# Altium project FreeJoy Controller Lite.PrjPcb
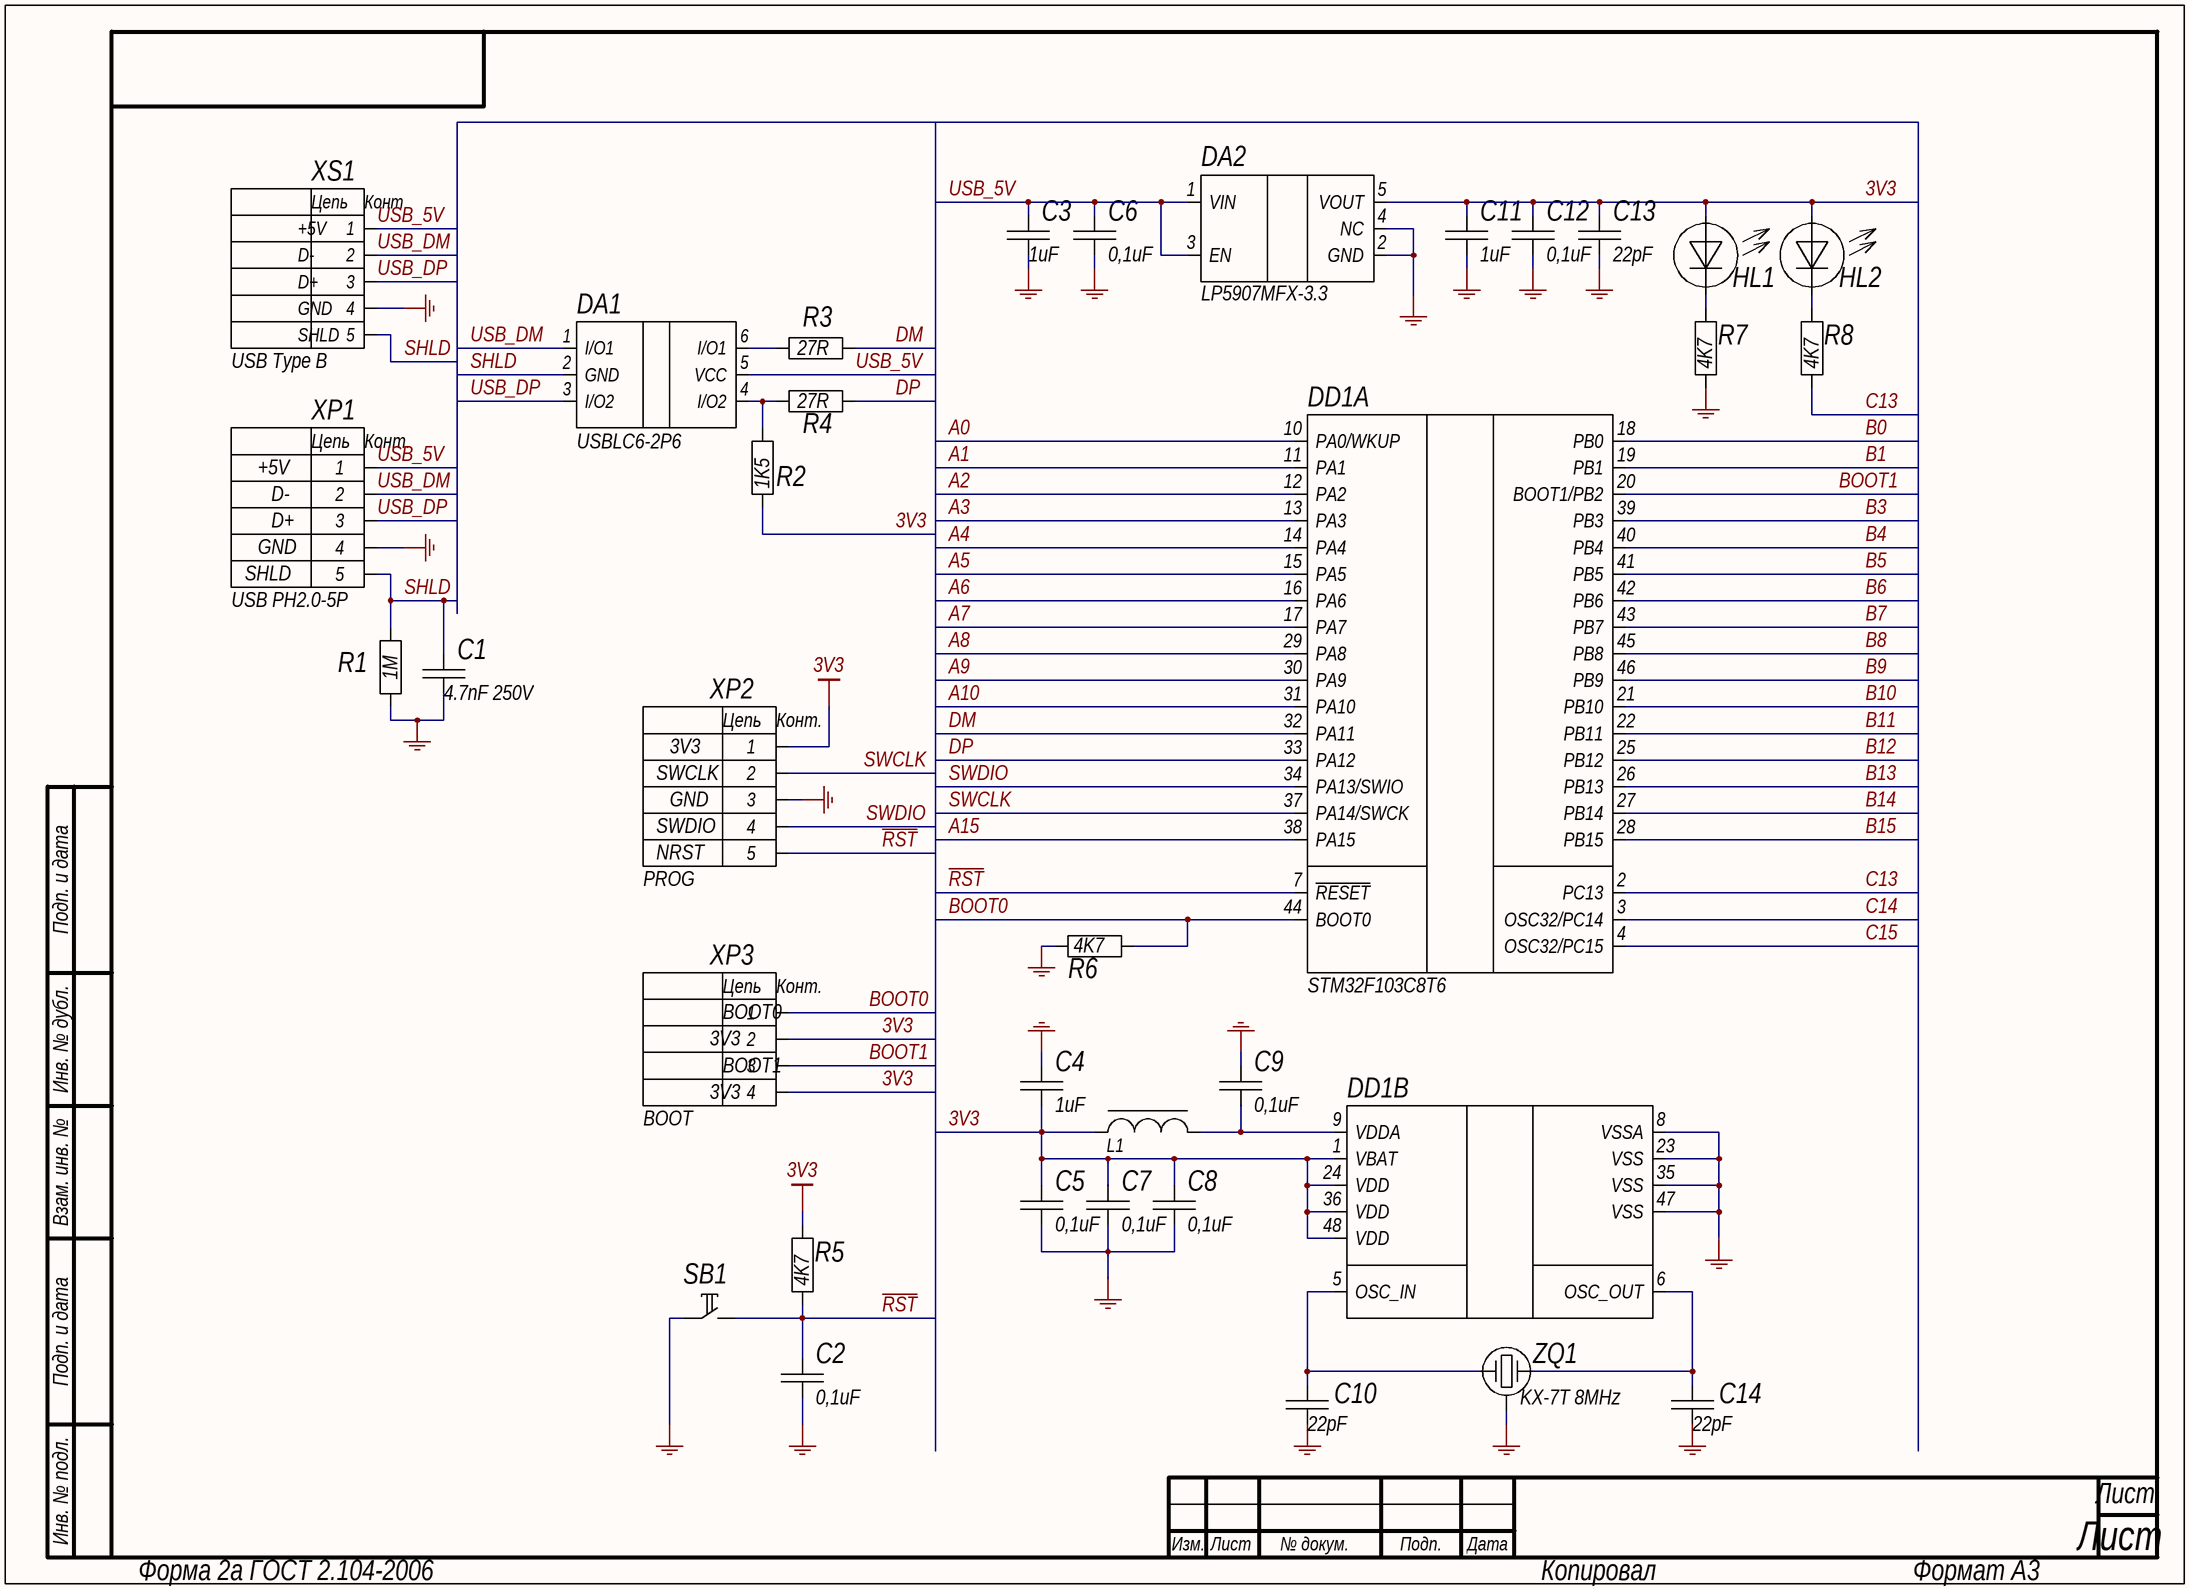
[diagram p0: Sheet1.SchDoc]
2 sheets, 47 parts. Net scope: global (net labels, ports and power ports of the same name join across sheets).
Board file: FreeJoy Controller Lite.PcbDoc
Sheets:
  Sheet1.SchDoc
  Sheet2.SchDoc

## Sheet Sheet1.SchDoc: =GlobalProjectName
size 410 x 297 mm; ApprovedBy: Утвердил; CheckedBy: Проверил; Author: Разработал; SheetNumber: Лист; SheetTotal: 1; PageSetup: Record=PageOptions|CenterHorizontal=True|CenterVertical=True|PrintScale=1.00|XCorrection=1.00|YCorrection=1.00|PrintKind=1|BorderSize=5000000|LeftOffset=0|BottomOffset=0|Orientation=2|PaperLength=1000|PaperWidth=1000|Scale=100|PaperSource=15|PrintQuality=1200|MediaType=1|DitherType=10|PaperKind=A3|PrintScaleMode=1; Weight: -; ScaleFactor: -; NormInspection: Норм.Контр.; Time: Листов

### Parts
C1  4.7nF 250V  [CC0805_HD]
C2  value 0,1uF  [CC0603_HD]  (hidden comment: 100nF)
C3  1uF  [CC0603_HD]
C4  1uF  [CC0603_HD]
C5  value 0,1uF  [CC0603_HD]  (hidden comment: 100nF)
C6  value 0,1uF  [CC0603_HD]  (hidden comment: 100nF)
C7  value 0,1uF  [CC0603_HD]  (hidden comment: 100nF)
C8  value 0,1uF  [CC0603_HD]  (hidden comment: 100nF)
C9  value 0,1uF  [CC0603_HD]  (hidden comment: 100nF)
C10  22pF  [CC0603_HD]
C11  1uF  [CC0603_HD]
C12  value 0,1uF  [CC0603_HD]  (hidden comment: 100nF)
C13  22pF  [CC0603_HD]
C14  22pF  [CC0603_HD]
DA1  USBLC6-2P6  [SOT666]
DA2  LP5907MFX-3.3  [SOT23-5]
DD1  STM32F103C8T6  [LQFP48]  (parts A,B of 2)
HL1  KP-1608SRC  [LED0603R_HD]  (value not drawn)
HL2  KP-1608SGC  [LED0603G_HD]  (value not drawn)
L1  Ferrite bead, BLM18HG102SN1D  [RC0603_HD]  (value not drawn)
R1  1M  [RC0603_HD]
R2  1K5  [RC0603_HD]
R3  27R  [RC0603_HD]
R4  27R  [RC0603_HD]
R5  4K7  [RC0603_HD]
R6  4K7  [RC0603_HD]
R7  4K7  [RC0603_HD]
R8  4K7  [RC0603_HD]
SB1  Tact Switch 3.5x6mm THT  [DTS-32]  (value not drawn)
XP1  USB PH2.0-5P  [PH2.0-5P]
XP2  PROG  [PLS-5]
XP3  BOOT  [PLD-4]
XS1  USB Type B  [DS1099-B]
ZQ1  KX-7T 8MHz  [CRYSTAL_3225]

### Nets
3V3: C4.1 C5.2 C7.2 C8.2 C11.2 C12.2 C13.2 DA2.5(VOUT) DD1.1(VBAT) DD1.24(VDD) DD1.36(VDD) DD1.48(VDD) HL1.A HL2.A L1.1 R2.2 R5.1 XP2.1 XP3.2 XP3.4
GND: C1.1 C2.1 C3.1 C4.2 C5.1 C6.1 C7.1 C8.1 C9.2 C10.1 C11.1 C12.1 C13.1 C14.1 DA2.2(GND) DA2.4(NC) DD1.8(VSSA) DD1.23(VSS) DD1.35(VSS) DD1.47(VSS) R1.1 R6.2 R7.2 SB1.1 XP1.4 XP2.3 XS1.4 ZQ1.3(GND)
A0: DD1.10(PA0/WKUP)
A1: DD1.11(PA1)
A2: DD1.12(PA2)
A3: DD1.13(PA3)
A4: DD1.14(PA4)
A5: DD1.15(PA5)
A6: DD1.16(PA6)
A7: DD1.17(PA7)
A8: DD1.29(PA8)
A9: DD1.30(PA9)
A10: DD1.31(PA10)
A15: DD1.38(PA15)
B0: DD1.18(PB0)
B1: DD1.19(PB1)
B3: DD1.39(PB3)
B4: DD1.40(PB4)
B5: DD1.41(PB5)
B6: DD1.42(PB6)
B7: DD1.43(PB7)
B8: DD1.45(PB8)
B9: DD1.46(PB9)
B10: DD1.21(PB10)
B11: DD1.22(PB11)
B12: DD1.25(PB12)
B13: DD1.26(PB13)
B14: DD1.27(PB14)
B15: DD1.28(PB15)
BOOT0: DD1.44(BOOT0) R6.1 XP3.1
BOOT1: DD1.20(BOOT1/PB2) XP3.3
C13: DD1.2(PC13) R8.1
C14: DD1.3(OSC32/PC14)
C15: DD1.4(OSC32/PC15)
DM: DD1.32(PA11) R3.2
DP: DD1.33(PA12) R4.2
~{RST}: C2.2 DD1.7(~{RESET}) R5.2 SB1.2 XP2.5
SHLD: C1.2 DA1.2(GND) R1.2 XP1.5 XS1.5
SWCLK: DD1.37(PA14/SWCK) XP2.2
SWDIO: DD1.34(PA13/SWIO) XP2.4
USB_5V: C3.2 C6.2 DA1.5(VCC) DA2.1(VIN) DA2.3(EN) XP1.1 XS1.1
USB_DM: DA1.1(I/O1) XP1.2 XS1.2
USB_DP: DA1.3(I/O2) XP1.3 XS1.3
NetC9_1: C9.1 DD1.9(VDDA) L1.2
NetC10_2: C10.2 DD1.5(OSC_IN) ZQ1.1
NetC14_2: C14.2 DD1.6(OSC_OUT) ZQ1.2
NetDA1_4: DA1.4(I/O2) R2.1 R4.1
NetDA1_6: DA1.6(I/O1) R3.1
NetHL1_C: HL1.C R7.1
NetHL2_C: HL2.C R8.2

### Notes on the sheet
- +5V
- D-
- D+
- SHLD
- GND
- SWCLK
- 3V3
- SWDIO
- NRST
- (near XP3) BOOT0
- (near XP3) BOOT1
- Подп. и дата
- Инв. № дубл.
- Взам. инв. №
- Инв. № подл.
- Изм.
- Лист
- № докум.
- Подп.
- Дата
- Форма 2а ГОСТ 2.104-2006
- Копировал
- Формат А3
- (in symbol Вилка DS1021-1x5) Цепь; Конт.
- (in symbol Вилка DS1021-2x2) Цепь; Конт.
- (in symbol Вилка PH2.0-5P) Цепь; Конт.
- (in symbol Гнездо DS1099) Цепь; Конт; +5V; D-; D+; GND; SHLD

### Library data of the parts
C1 = Конденсатор 0805 250 В 4,7 нФ ±10% X7R: 4700pF ± 5%, 250V, X7R, SMD 0805; Value: Конденсатор 0805 250 В 4,7 нФ ±10% X7R
C2 C5-C9 C12 = Конденсатор 0603 50 В 0,1 мкФ ±10% X7R: 0.1uF ± 10%, 25V, X7R, SMD 0603
C3 C4 C11 = Конденсатор 0603 16 В 1 мкФ ±10% X7R: 1uF ± 10%, 16V, X7R, SMD 0603; Value: Конденсатор 0603 6,3 В 1 мкФ ±10% X5R
C10 C13 C14 = Конденсатор 0603 50В 22 пФ ±5% NP0: 22pF ± 5%, 50V, NPO, SMD 0603; Value: Конденсатор 0603 50В 22 пФ ±5% NP0
DA1 = Диодная сборка USBLC6-2P6: ESR protection IC, USBLC6-2P6, SOT666; Value: Диодная сборка USBLC6-2SC6
DA2 = Микросхема LP5907MFX-3.3: LDO voltage regulator, LP5907MFX-3.3, SOT23-5
DD1 = Микросхема STM32F103C8T6: MCU, STM32F103C8T6, LQFP48
HL1 = Светодиод KP-1608SRC: KP-1608SRC, LED red, SMD 0603; Value: Светодиод KP-1608SRC
HL2 = Светодиод KP-1608SGC: KP-1608SGC, LED green, SMD 0603; Value: Светодиод KP-1608SGC
L1 = Индуктивность BLM18HG102SN1D: BLM18HG102SN1D, SMD 0603
R1 = Резистор RC0603FR-071ML: 1M ± 1%, SMD 0603; Value: Резистор 0603
R2 = Резистор RC0603FR-071K5L: 1K5 ± 1%, SMD 0603; Value: Резистор 0603
R3 R4 = Резистор RC0603FR-0727RL: 27R ± 1%, SMD 0603; Value: Резистор 0603
R5-R8 = Резистор RC0603FR-074K7L: 4K7 ± 1%, SMD 0603; Value: Резистор 0603
SB1 = Кнопка DTS-32: DTS-32, 3.5x6mm, THT
XP1 = Вилка PH2.0-5P: PH2.0-5P; Value: Гнездо PBS-12
XP2 = Вилка DS1021-1x5: PLS-5; Value: Вилка PLS-10
XP3 = Вилка DS1021-2x2: PLD-4; Value: Вилка PLD-4
XS1 = Гнездо DS1099: DS1099, USB Type B Socket
ZQ1 = Кварцевый резонатор KX-7T 8 МГц: Crystal Resonator, 8MHz, KX-7T; Value: Кварцевый резонатор MJ-8.000-12

## Sheet Sheet2.SchDoc: =GlobalProjectName
size 410 x 297 mm; ApprovedBy: Утвердил; CheckedBy: Проверил; Author: Разработал; SheetNumber: Лист; SheetTotal: 1; PageSetup: Record=PageOptions|CenterHorizontal=True|CenterVertical=True|PrintScale=1.00|XCorrection=1.00|YCorrection=1.00|PrintKind=1|BorderSize=5000000|LeftOffset=0|BottomOffset=0|Orientation=2|PaperLength=1000|PaperWidth=1000|Scale=100|PaperSource=15|PrintQuality=1200|MediaType=1|DitherType=10|PaperKind=A3|PrintScaleMode=1; Weight: -; ScaleFactor: -; NormInspection: Норм.Контр.; Time: Листов
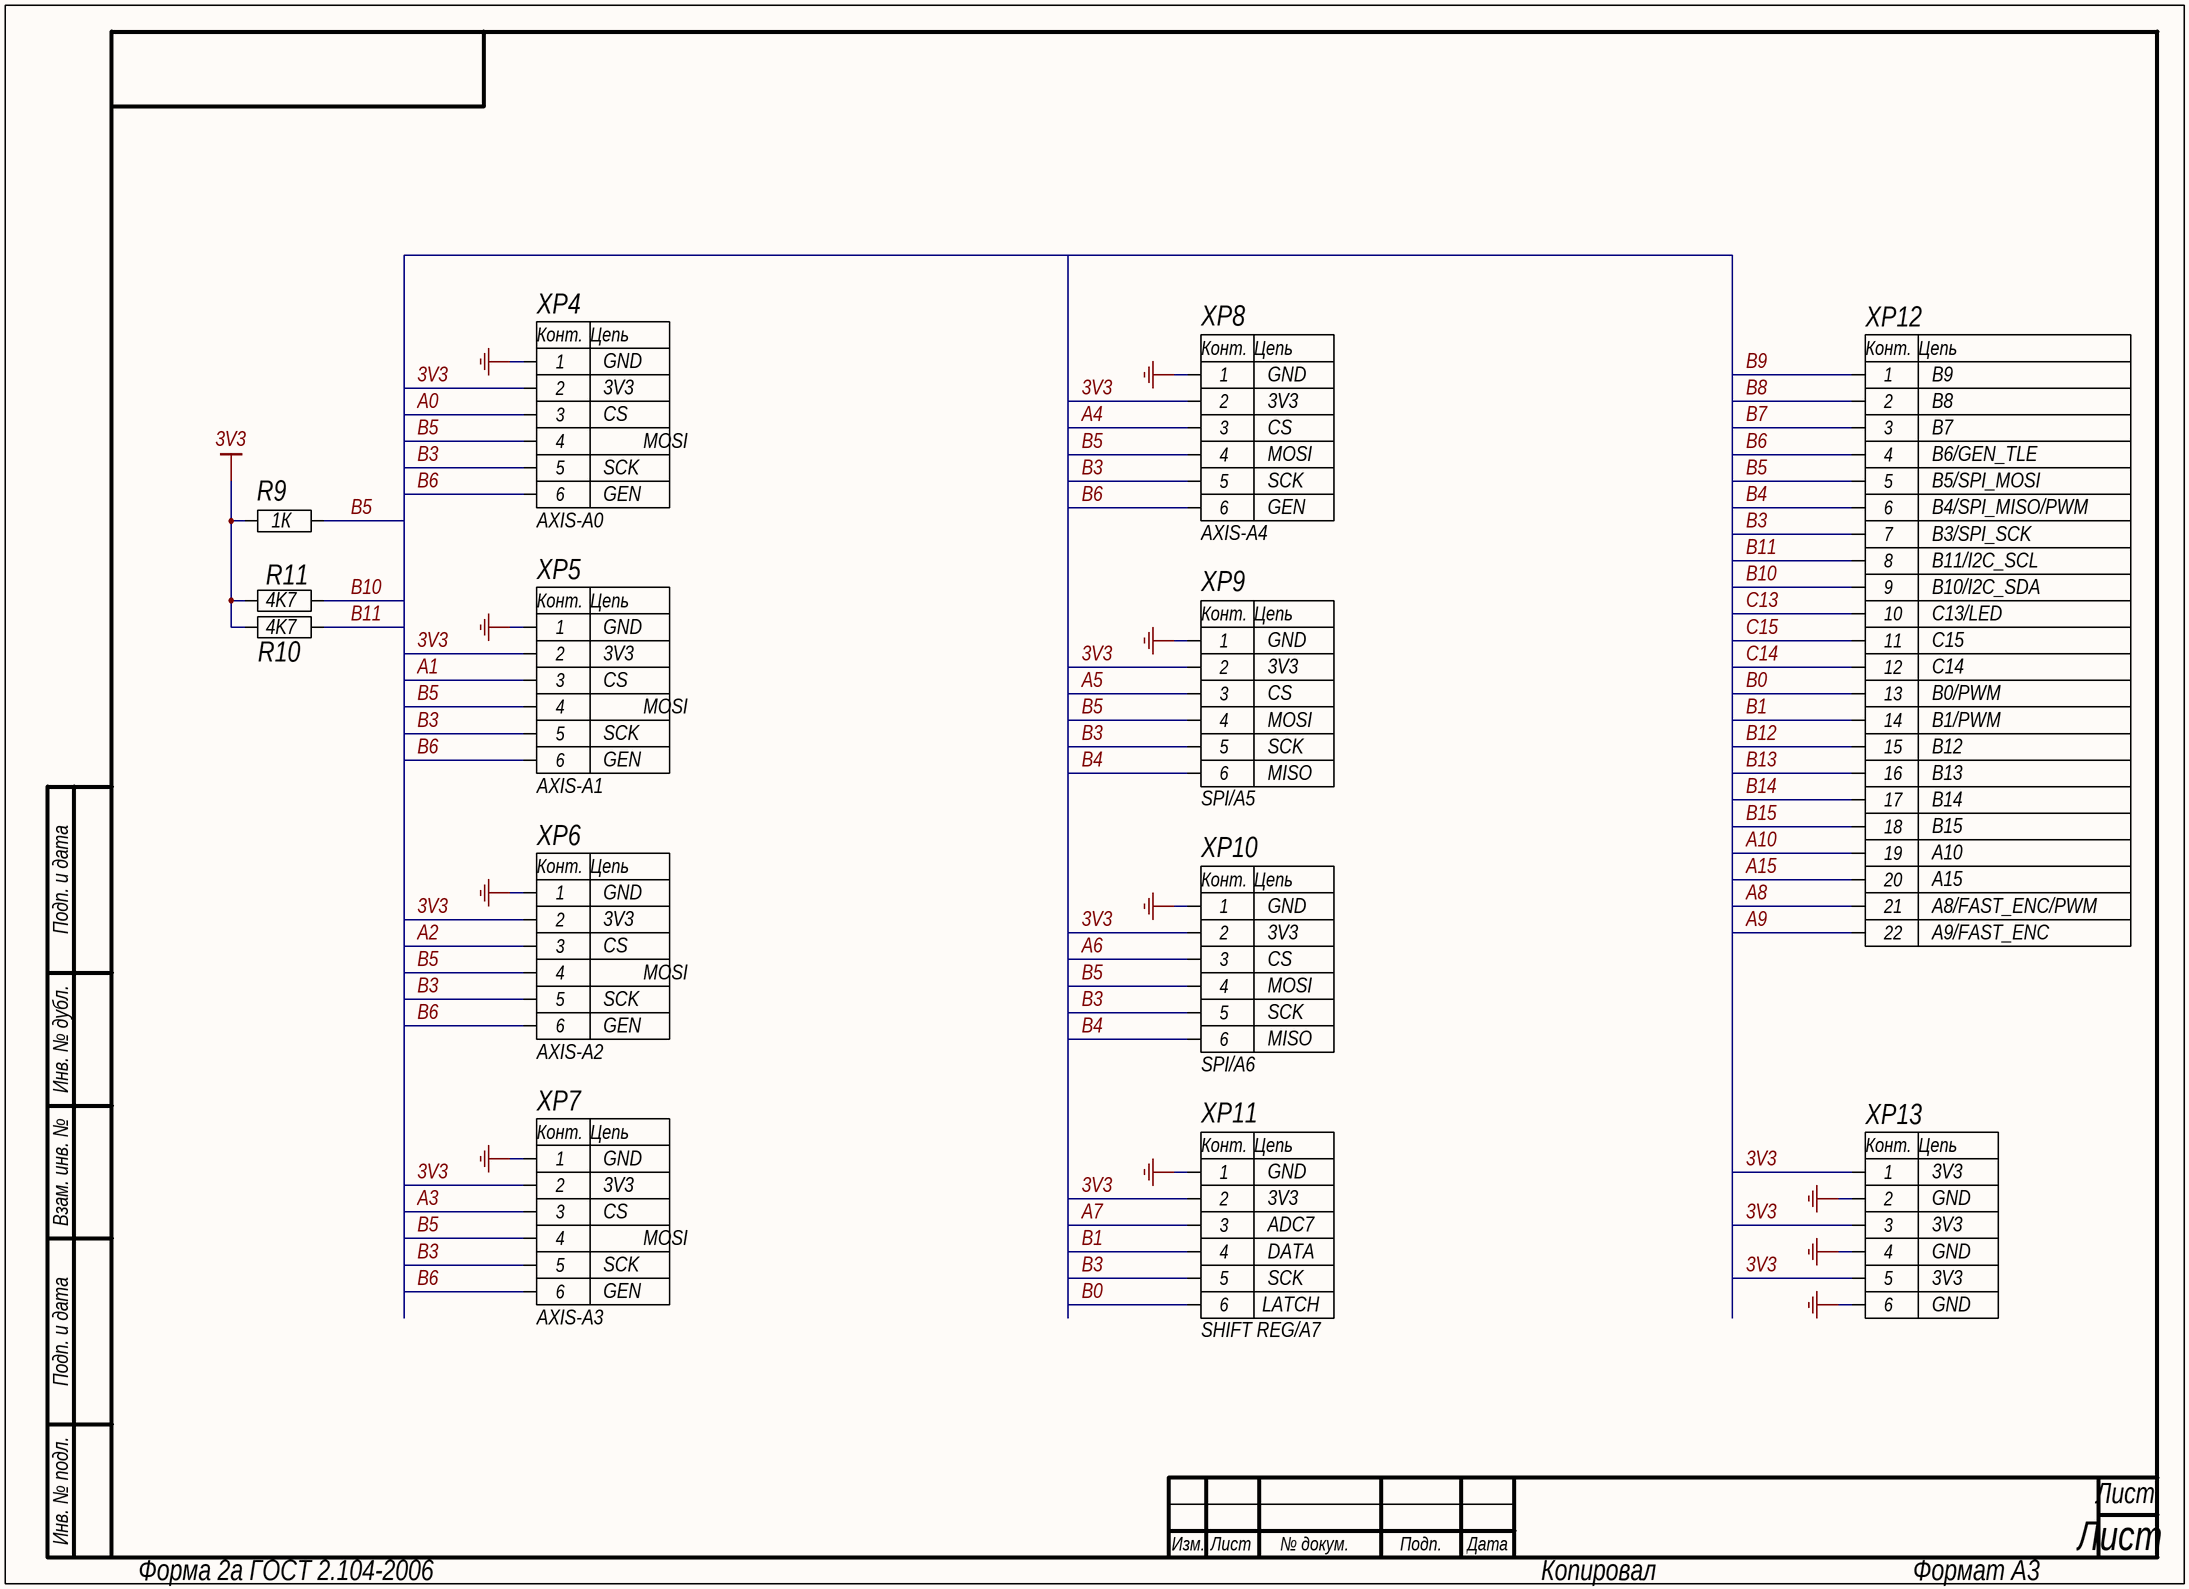
[diagram p1: Sheet2.SchDoc]

### Parts
R9  1К  [RC0603_HD]
R10  4K7  [RC0603_HD]
R11  4K7  [RC0603_HD]
XP4  AXIS-A0  [PH2.0-6P]
XP5  AXIS-A1  [PH2.0-6P]
XP6  AXIS-A2  [PH2.0-6P]
XP7  AXIS-A3  [PH2.0-6P]
XP8  AXIS-A4  [PH2.0-6P]
XP9  SPI/A5  [PH2.0-6P]
XP10  SPI/A6  [PH2.0-6P]
XP11  SHIFT REG/A7  [PH2.0-6P]
XP12  GPIO  [PLD-22]  (value not drawn)
XP13  SUPPLY  [PLD-6]  (value not drawn)

### Nets
3V3: R9.2 R10.1 R11.1 XP4.2 XP5.2 XP6.2 XP7.2 XP8.2 XP9.2 XP10.2 XP11.2 XP13.1 XP13.3 XP13.5
GND: XP4.1 XP5.1 XP6.1 XP7.1 XP8.1 XP9.1 XP10.1 XP11.1 XP13.2 XP13.4 XP13.6
A0: XP4.3
A1: XP5.3
A2: XP6.3
A3: XP7.3
A4: XP8.3
A5: XP9.3
A6: XP10.3
A7: XP11.3
A8: XP12.21
A9: XP12.22
A10: XP12.19
A15: XP12.20
B0: XP11.6 XP12.13
B1: XP11.4 XP12.14
B3: XP4.5 XP5.5 XP6.5 XP7.5 XP8.5 XP9.5 XP10.5 XP11.5 XP12.7
B4: XP9.6 XP10.6 XP12.6
B5: R9.1 XP4.4 XP5.4 XP6.4 XP7.4 XP8.4 XP9.4 XP10.4 XP12.5
B6: XP4.6 XP5.6 XP6.6 XP7.6 XP8.6 XP12.4
B7: XP12.3
B8: XP12.2
B9: XP12.1
B10: R11.2 XP12.9
B11: R10.2 XP12.8
B12: XP12.15
B13: XP12.16
B14: XP12.17
B15: XP12.18
C13: XP12.10
C14: XP12.12
C15: XP12.11

### Notes on the sheet
- 3V3
- GND
- B9
- CS
- MOSI
- B8
- B6/GEN_TLE
- B7
- SCK
- GEN
- B4/SPI_MISO/PWM
- B5/SPI_MOSI
- B3/SPI_SCK
- B10/I2C_SDA
- B11/I2C_SCL
- C15
- C13/LED
- C14
- B1/PWM
- B0/PWM
- MISO
- B12
- B13
- B14
- B15
- A10
- A8/FAST_ENC/PWM
- A15
- A9/FAST_ENC
- DATA
- ADC7
- LATCH
- Подп. и дата
- Инв. № дубл.
- Взам. инв. №
- Инв. № подл.
- Изм.
- Лист
- № докум.
- Подп.
- Дата
- Форма 2а ГОСТ 2.104-2006
- Копировал
- Формат А3
- (in symbol Вилка DS1021-2x3) Конт.; Цепь
- (in symbol Вилка DS1021-2x11) Конт.; Цепь
- (in symbol Вилка PH2.0-6P) Конт.; Цепь

### Library data of the parts
R9 = Резистор RC0603FR-071KL: 1K ± 1%, SMD 0603; Value: Резистор 0603
R10 R11 = Резистор RC0603FR-074K7L: 4K7 ± 1%, SMD 0603; Value: Резистор 0603
XP4-XP11 = Вилка PH2.0-6P: PH2.0-6P; Value: Гнездо PBS-12
XP12 = Вилка DS1021-2x11: PLD-22; Value: Вилка PLD-22
XP13 = Вилка DS1021-2x3: PLD-6; Value: Вилка PLD-6

## Nets that join several sheets
3V3: Sheet1 (20 pins), Sheet2 (14 pins)
GND: Sheet1 (28 pins), Sheet2 (11 pins)
A0: Sheet1 (DD1.10), Sheet2 (XP4.3)
A1: Sheet1 (DD1.11), Sheet2 (XP5.3)
A2: Sheet1 (DD1.12), Sheet2 (XP6.3)
A3: Sheet1 (DD1.13), Sheet2 (XP7.3)
A4: Sheet1 (DD1.14), Sheet2 (XP8.3)
A5: Sheet1 (DD1.15), Sheet2 (XP9.3)
A6: Sheet1 (DD1.16), Sheet2 (XP10.3)
A7: Sheet1 (DD1.17), Sheet2 (XP11.3)
A8: Sheet1 (DD1.29), Sheet2 (XP12.21)
A9: Sheet1 (DD1.30), Sheet2 (XP12.22)
A10: Sheet1 (DD1.31), Sheet2 (XP12.19)
A15: Sheet1 (DD1.38), Sheet2 (XP12.20)
B0: Sheet1 (DD1.18), Sheet2 (XP11.6 XP12.13)
B1: Sheet1 (DD1.19), Sheet2 (XP11.4 XP12.14)
B3: Sheet1 (DD1.39), Sheet2 (9 pins)
B4: Sheet1 (DD1.40), Sheet2 (XP9.6 XP10.6 XP12.6)
B5: Sheet1 (DD1.41), Sheet2 (9 pins)
B6: Sheet1 (DD1.42), Sheet2 (6 pins)
B7: Sheet1 (DD1.43), Sheet2 (XP12.3)
B8: Sheet1 (DD1.45), Sheet2 (XP12.2)
B9: Sheet1 (DD1.46), Sheet2 (XP12.1)
B10: Sheet1 (DD1.21), Sheet2 (R11.2 XP12.9)
B11: Sheet1 (DD1.22), Sheet2 (R10.2 XP12.8)
B12: Sheet1 (DD1.25), Sheet2 (XP12.15)
B13: Sheet1 (DD1.26), Sheet2 (XP12.16)
B14: Sheet1 (DD1.27), Sheet2 (XP12.17)
B15: Sheet1 (DD1.28), Sheet2 (XP12.18)
C13: Sheet1 (DD1.2 R8.1), Sheet2 (XP12.10)
C14: Sheet1 (DD1.3), Sheet2 (XP12.12)
C15: Sheet1 (DD1.4), Sheet2 (XP12.11)